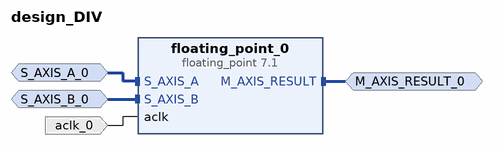
[diagram p0: block diagram of the top level]
# Vivado block design design_DIV, xczu7ev-ffvc1156-2-e, Vivado 2018.3
create_bd_design design_DIV

create_bd_intf_port -mode Master -vlnv xilinx.com:interface:axis_rtl:1.0 M_AXIS_RESULT_0
set_property -dict {CONFIG.FREQ_HZ 10000000} [get_bd_intf_ports M_AXIS_RESULT_0]
create_bd_intf_port -mode Slave -vlnv xilinx.com:interface:axis_rtl:1.0 S_AXIS_A_0
set_property -dict [list \
  CONFIG.FREQ_HZ 10000000 \
  CONFIG.HAS_TKEEP 0 \
  CONFIG.HAS_TLAST 0 \
  CONFIG.HAS_TREADY 1 \
  CONFIG.HAS_TSTRB 0 \
  CONFIG.LAYERED_METADATA undef \
  CONFIG.TDATA_NUM_BYTES 8 \
  CONFIG.TDEST_WIDTH 0 \
  CONFIG.TID_WIDTH 0 \
  CONFIG.TUSER_WIDTH 0 \
] [get_bd_intf_ports S_AXIS_A_0]
create_bd_intf_port -mode Slave -vlnv xilinx.com:interface:axis_rtl:1.0 S_AXIS_B_0
set_property -dict [list \
  CONFIG.FREQ_HZ 10000000 \
  CONFIG.HAS_TKEEP 0 \
  CONFIG.HAS_TLAST 0 \
  CONFIG.HAS_TREADY 1 \
  CONFIG.HAS_TSTRB 0 \
  CONFIG.LAYERED_METADATA undef \
  CONFIG.TDATA_NUM_BYTES 8 \
  CONFIG.TDEST_WIDTH 0 \
  CONFIG.TID_WIDTH 0 \
  CONFIG.TUSER_WIDTH 0 \
] [get_bd_intf_ports S_AXIS_B_0]
create_bd_port -dir I -type clk aclk_0
set_property -dict {CONFIG.FREQ_HZ 10000000} [get_bd_ports aclk_0]

create_bd_cell -type ip -vlnv xilinx.com:ip:floating_point:7.1 floating_point_0
set_property -dict [list \
  CONFIG.A_Precision_Type Double \
  CONFIG.Axi_Optimize_Goal Performance \
  CONFIG.C_Accum_Input_Msb 32 \
  CONFIG.C_Accum_Lsb -31 \
  CONFIG.C_Accum_Msb 32 \
  CONFIG.C_Latency 31 \
  CONFIG.C_Mult_Usage No_Usage \
  CONFIG.C_Rate 1 \
  CONFIG.C_Result_Exponent_Width 11 \
  CONFIG.C_Result_Fraction_Width 53 \
  CONFIG.Maximum_Latency false \
  CONFIG.Operation_Type Divide \
  CONFIG.Result_Precision_Type Double \
] [get_bd_cells floating_point_0]

# ---- connections ----

connect_bd_intf_net [get_bd_intf_ports M_AXIS_RESULT_0] [get_bd_intf_pins floating_point_0/M_AXIS_RESULT]
connect_bd_intf_net -intf_net S_AXIS_A_0_1 [get_bd_intf_ports S_AXIS_A_0] [get_bd_intf_pins floating_point_0/S_AXIS_A]
connect_bd_intf_net -intf_net S_AXIS_B_0_1 [get_bd_intf_ports S_AXIS_B_0] [get_bd_intf_pins floating_point_0/S_AXIS_B]
connect_bd_net -net aclk_0_1 [get_bd_ports aclk_0] [get_bd_pins floating_point_0/aclk]

validate_bd_design
save_bd_design
